# Altium schematic sheet flash.SchDoc
size A3; DocumentNumber: 32; SheetNumber: 32; SheetTotal: 45; SheetDescription: NOR Flash memory
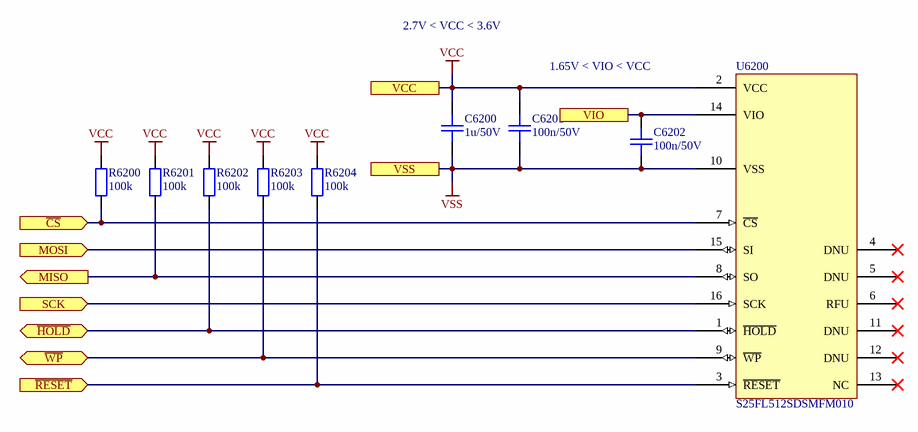
[diagram p0: flash.SchDoc]

## Parts
C6200  1u/50V  [CAPC1608X08N]
C6201  100n/50V  [CAPC1005X06N]
C6202  100n/50V  [CAPC1005X06N]
R6200  100k  [RESC1005X04N]
R6201  100k  [RESC1005X04N]
R6202  100k  [RESC1005X04N]
R6203  100k  [RESC1005X04N]
R6204  100k  [RESC1005X04N]
U6200  S25FL512SDSMFM010  [S25FL512S-SO3016]

## Ports
MISO (out), MOSI (in), SCK (in), VCC, VIO, VSS, ~{CS} (in), ~{HOLD} (bidir), ~{RESET} (in), ~{WP} (bidir)

## Nets
VCC: C6200.2 C6201.2 R6200.2 R6201.2 R6202.2 R6203.2 R6204.2 U6200.2(VCC) ; port VCC
VSS: C6200.1 C6201.1 C6202.1 U6200.10(VSS) ; port VSS
~{CS}: R6200.1 U6200.7(~{CS}) ; port ~{CS}
~{HOLD}: R6202.1 U6200.1(~{HOLD}) ; port ~{HOLD}
~{RESET}: R6204.1 U6200.3(~{RESET}) ; port ~{RESET}
~{WP}: R6203.1 U6200.9(~{WP}) ; port ~{WP}
MISO: R6201.1 U6200.8(SO) ; port MISO
MOSI: U6200.15(SI) ; port MOSI
SCK: U6200.16(SCK) ; port SCK
VIO: C6202.2 U6200.14(VIO) ; port VIO

Not connected (* = marked no-connect by the designer): U6200 4(DNU)* 5(DNU)* 6(RFU)* 11(DNU)* 12(DNU)* 13(NC)*

## Notes on the sheet
- 2.7V < VCC < 3.6V
- 1.65V < VIO < VCC
- Fraunhofer IISB
- Schottkystr. 10
- developed by:
- 91058 Erlangen
- Germany
- Author
- Project
- License
- Description
- File
- Version
- Release Date
- Sheet
- foxbms.org <https://foxbms.org>
- www.iisb.fraunhofer.de <https://www.iisb.fraunhofer.de/>
- foxBMS Team
- /

## Library data of the parts
C6200 = gen_C_ceramic_1u_50V_X7R_0603: MLCC; Capacitance: 1u; Rated Voltage: 50V; Dielectric: X7R; Case EIA: 0603; Case Metric: 1608; Automotive Qualified: False; Tolerance: ± 10%; PnP Package: 0603C; Part Number: gen_C_ceramic_1u_50V_X7R_0603; Operating Temperature: -55°C - +125°C; Supplier 1: Farnell; Supplier Part Number 1: 2779055
C6201 C6202 = gen_C_ceramic_100n_50V_X7R_0402: MLCC; Capacitance: 100n; Rated Voltage: 50V; Dielectric: X7R; Case EIA: 0402; Case Metric: 1005; PnP Package: 0402C; PnP Value: 100nF/50V/X7R; PnP equipped: x; Automotive Qualified: True; AEC-Q Norm: AEC-Q200; Part Number: gen_C_ceramic_100n_50V_X7R_0402; Supplier 1: Farnell; Supplier Part Number 1: 2210822; ECCN: EAR99
R6200-R6204 = gen_R_100k_0402: SMD Resistor 100k 0402; Tolerance: 1%; Power: 0.063W; Case EIA: 0402; Case Metric: 1005; Maximum Working Voltage: 50V; PnP Package: 0402R; PnP equipped: x; Automotive Qualified: True; Part Number: gen_R_100k_0402; Operating Temperature: -55°C - +155°C; Resistance: 100k; Series: E24, E96; PnP Value: 100k; Supplier 1: Farnell; Supplier Part Number 1: 2302839
U6200 = S25FL512SDSMFM010: 512 Mbit (64 Mbyte), 3.0 V SPI Flash Memory; Manufacturer: Cypress; PnP Package: SOIC-16; Automotive Qualified: True; Part Number: S25FL512SDSMFM010; Part Name: S25FL512SDSMFM010; Operating Temperature: −40°C - +125°C; ComponentLink1Description: Datasheet; ComponentLink1URL: https://www.cypress.com/file/177971/download; Supplier 1: Mouser; Supplier Part Number 1: 727-S25FL512SSMFM010; Supplier 2: Digikey; Supplier Part Number 2: S25FL512SDSMFM010-ND